# EAGLE schematic PushUpCounterV1-1 (EAGLE 9.5.2)
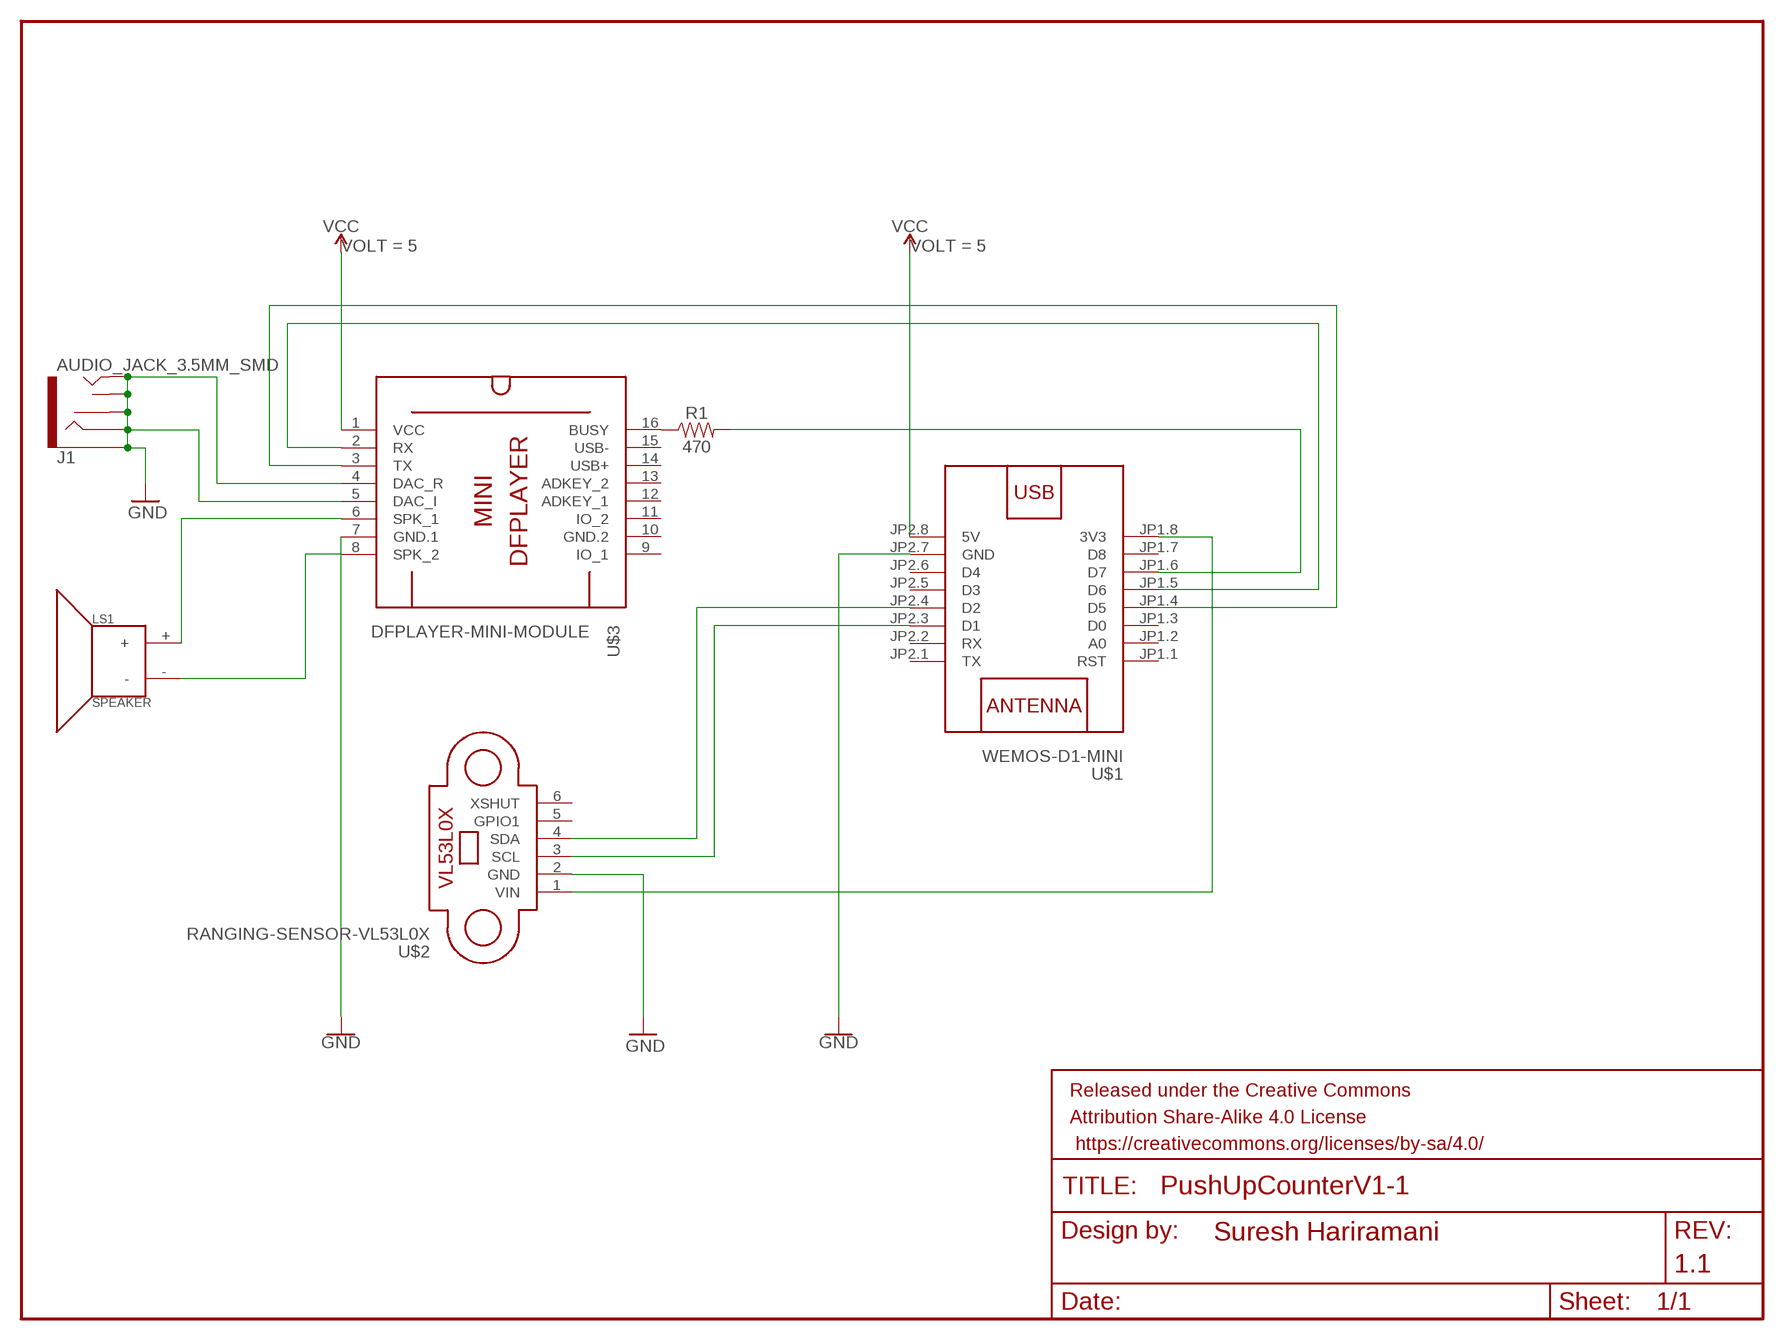
[diagram p0: schematic, sheet 1]

## Parts
FRAME1  FRAME-LETTER  [CREATIVE_COMMONS]
J1  AUDIO_JACK_3.5MM_SMD  [AUDIO-JACK-3.5MM-SMD]
LS1  SPEAKER  [PCB_MOUNT_SPEAKER]
R1  470  470OHM-0603-1/10W-1%  [0603]
U$1  WEMOS-D1-MINI  [WEMOS-D1-MINI]
U$2  RANGING-SENSOR-VL53L0X  [RANGING-SENSOR-VL53L0X]
U$3  DFPLAYER-MINI-MODULE  [DFPLAYER-MINI-MODULE]

## Nets
GND: J1.RING J1.RSH J1.SLEEVE J1.TIP J1.TSH U$1.JP2.7(GND) U$2.2(GND) U$3.4(DAC_R) U$3.5(DAC_I) U$3.7(GND.1)
N$1: LS1.+ U$3.6(SPK_1)
N$2: LS1.- U$3.8(SPK_2)
N$3: R1.2 U$1.JP1.6(D7)
N$4: R1.1 U$3.16(BUSY)
N$6: U$1.JP1.5(D6) U$3.2(RX)
N$7: U$1.JP1.4(D5) U$3.3(TX)
N$8: U$1.JP2.4(D2) U$2.4(SDA)
N$9: U$1.JP2.3(D1) U$2.3(SCL)
N$10: U$1.JP1.8(3V3) U$2.1(VIN)
VCC: U$1.JP2.8(5V) U$3.1(VCC)
Unconnected: U$1.JP1.1(RST) U$1.JP1.2(A0) U$1.JP1.3(D0) U$1.JP1.7(D8) U$1.JP2.1(TX) U$1.JP2.2(RX) U$1.JP2.5(D3) U$1.JP2.6(D4) U$2.5(GPIO1) U$2.6(XSHUT) U$3.9(IO_1) U$3.11(IO_2) U$3.12(ADKEY_1) U$3.13(ADKEY_2) U$3.14(USB+) U$3.15(USB-)

## Power pins joined to a net without a drawn wire
GND.2: U$3.10(GND.2)

## Library data of the parts
FRAME1 = SparkFun-Aesthetics:FRAME-LETTER: Schematic Frame - Letter Standard 8.5x11 US Letter frame; DESIGNER: Suresh Hariramani; REV: 1.1
J1 = SparkFun-Connectors:AUDIO_JACK_3.5MM: Audio Jack 3.5mm variants of PTH and SMT stereo audio jack with bypass switches. SparkFun Products: SparkFun SparkPunk Sound Kit <[https://www.sparkfun.com/products/11177]> - PTH MP3 Trigger <https://www.sparkfun.com/products/13720> -3.5mm SMD SparkFun PicoBoard <https://www.sparkfun.com/products/11888>- 2.5mm SMD; PROD_ID: CONN-10353
LS1 = SparkFun-Electromechanical:SPEAKER: Speaker Generic 2-terminal loudspeakers SparkFun Products Speaker - PCB Mount <https://www.sparkfun.com/products/11089> (COM-11089); PROD_ID: COMP-11789; SF_SKU: COM-11089
R1 = SparkFun-Resistors:470OHM: 470Ω resistor A resistor is a passive two-terminal electrical component that implements electrical resistance as a circuit element. Resistors act to reduce current flow, and, at the same time, act to lower voltage levels within circuits. - Wikipedia; PROD_ID: RES-07869
U$1 = diy-modules:WEMOS-D1-MINI: WEMOS D1 mini: Mini Wi-Fi Board based on ESP-8266 device More details can be found here: https://www.wemos.cc/product/d1-mini.html Click here to find device on ebay.com <http://www.ebay.com/sch/wemos+d1+mini+nodemcu>
U$2 = diy-modules:RANGING-SENSOR-VL53L0X: Laser Ranging Sensor based on VL53L0X device More information about VL53L0X device can be found here: http://www.st.com/en/imaging-and-photonics-solutions/vl53l0x.html Arduino Library for VL53L0X is available here: https://github.com/pololu/vl53l0x-arduino Click here to find device on ebay.com <http://www.ebay.com/sch/GY+VL53L0X+module> Note: There are many variants. Search for the proper version.
U$3 = diy-modules:DFPLAYER-MINI-MODULE: DFPlayer Mini - MP3 player module based on YX5200 chip More details available here: https://www.dfrobot.com/wiki/index.php/DFPlayer_Mini_SKU:DFR0299 Click here to find device on ebay.com <http://www.ebay.com/sch/dfplayer+mini>